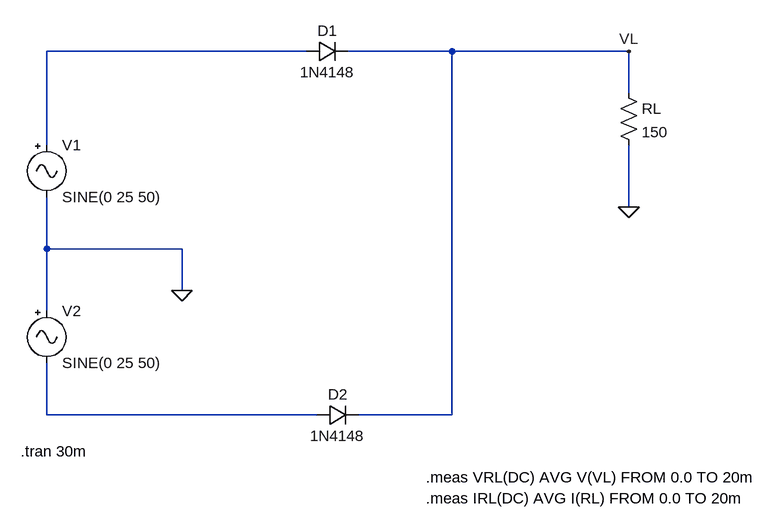
[diagram p0: schematic tam_dalga_itü.asc]
tam_dalga_itü.asc, the LTspice schematic file:
Version 4
SHEET 1 1260 680
WIRE 544 -64 144 -64
WIRE 768 -64 608 -64
WIRE 1040 -64 768 -64
WIRE 1040 0 1040 -64
WIRE 144 80 144 -64
WIRE 1040 176 1040 80
WIRE 144 240 144 160
WIRE 352 240 144 240
WIRE 352 304 352 240
WIRE 144 336 144 240
WIRE 144 496 144 416
WIRE 560 496 144 496
WIRE 768 496 768 -64
WIRE 768 496 624 496
FLAG 352 304 0
FLAG 1040 176 0
FLAG 1040 -64 VL
SYMBOL Misc\\signal 144 64 R0
WINDOW 123 0 0 Left 0
WINDOW 39 0 0 Left 0
SYMATTR InstName V1
SYMATTR Value SINE(0 25 50)
SYMBOL Misc\\signal 144 320 R0
WINDOW 123 0 0 Left 0
WINDOW 39 0 0 Left 0
SYMATTR InstName V2
SYMATTR Value SINE(0 25 50)
SYMBOL diode 544 -48 R270
WINDOW 0 32 32 VTop 2
WINDOW 3 0 32 VBottom 2
SYMATTR InstName D1
SYMATTR Value 1N4148
SYMBOL diode 560 512 R270
WINDOW 0 32 32 VTop 2
WINDOW 3 0 32 VBottom 2
SYMATTR InstName D2
SYMATTR Value 1N4148
SYMBOL res 1024 -16 R0
SYMATTR InstName RL
SYMATTR Value 150
TEXT 104 552 Left 2 !.tran 30m
TEXT 728 592 Left 2 !.meas VRL(DC) AVG V(VL) FROM 0.0 TO 20m
TEXT 728 624 Left 2 !.meas IRL(DC) AVG I(RL) FROM 0.0 TO 20m

The netlist it stands for:
* tam_dalga_itü.asc
V1 N001 0 SINE(0 25 50)
V2 0 N002 SINE(0 25 50)
D1 N001 VL 1N4148
D2 N002 VL 1N4148
RL VL 0 150
.model D D
.lib standard.dio
.tran 30m
.meas VRL(DC) AVG V(VL) FROM 0.0 TO 20m
.meas IRL(DC) AVG I(RL) FROM 0.0 TO 20m
.backanno
.end